# Altium schematic sheet SingleASIC.SchDoc
size A
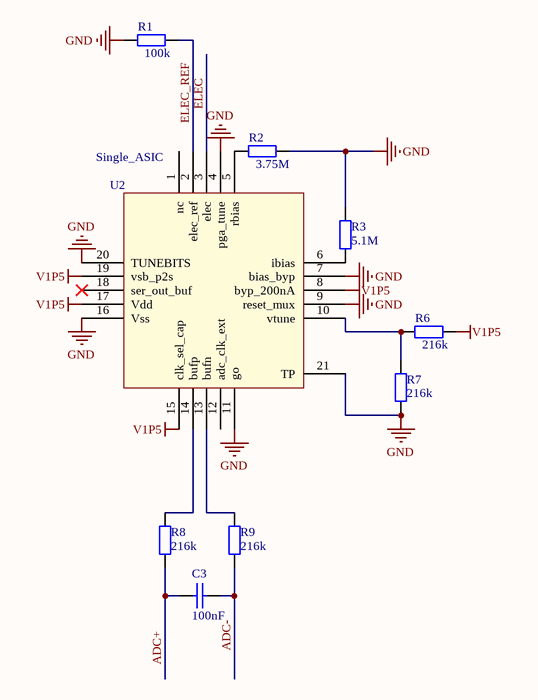
[diagram p0: SingleASIC.SchDoc]

## Parts
C3  value 100nF  [0402L]  (hidden comment: NP0 50V)
R1  value 100k  [0402L]  (hidden comment: Res2)
R2  value 3.75M  [0402L]  (hidden comment: Res2)
R3  value 5.1M  [0402L]  (hidden comment: Res2)
R6  value 216k  [0402L]  (hidden comment: Res2)
R7  value 216k  [0402L]  (hidden comment: Res2)
R8  value 216k  [0402L]  (hidden comment: Res2)
R9  value 216k  [0402L]  (hidden comment: Res2)
U2  Single_ASIC  [Single_ASIC]

## Nets
GND: R1.1 R2.2 R3.2 R7.1 U2.4(pga_tune) U2.7(bias_byp) U2.9(reset_mux) U2.11(go) U2.16(Vss) U2.20(TUNEBITS) U2.21(TP)
V1P5: R6.2 U2.8(byp_200nA) U2.15(clk_sel_cap) U2.17(Vdd) U2.19(vsb_p2s)
ADC+: C3.1 R8.1
ADC-: C3.2 R9.1
ELEC: U2.3(elec)
ELEC_REF: R1.2 U2.2(elec_ref)
NetR2_1: R2.1 U2.5(rbias)
NetR3_1: R3.1 U2.6(ibias)
NetR6_1: R6.1 R7.2 U2.10(vtune)
NetR8_2: R8.2 U2.14(bufp)
NetR9_2: R9.2 U2.13(bufn)

Not connected (* = marked no-connect by the designer): U2 1(nc) 12(adc_clk_ext) 18(ser_out_buf)*

## Library data of the parts
C3 = Cap: Capacitor; Part Field 1: 0402
R1-R3 R6-R9 = Res2: Resistor; Published: 8-Jun-2000; LatestRevisionDate: 17-Jul-2002; LatestRevisionNote: Re-released for DXP Platform.; PackageReference: AXIAL-0.4; Publisher: Altium Limited; PackageDescription: Axial Device, Thru-Hole; 2 Leads; 0.4 in Pin Spacing